# Altium schematic sheet Power.SchDoc
size A4
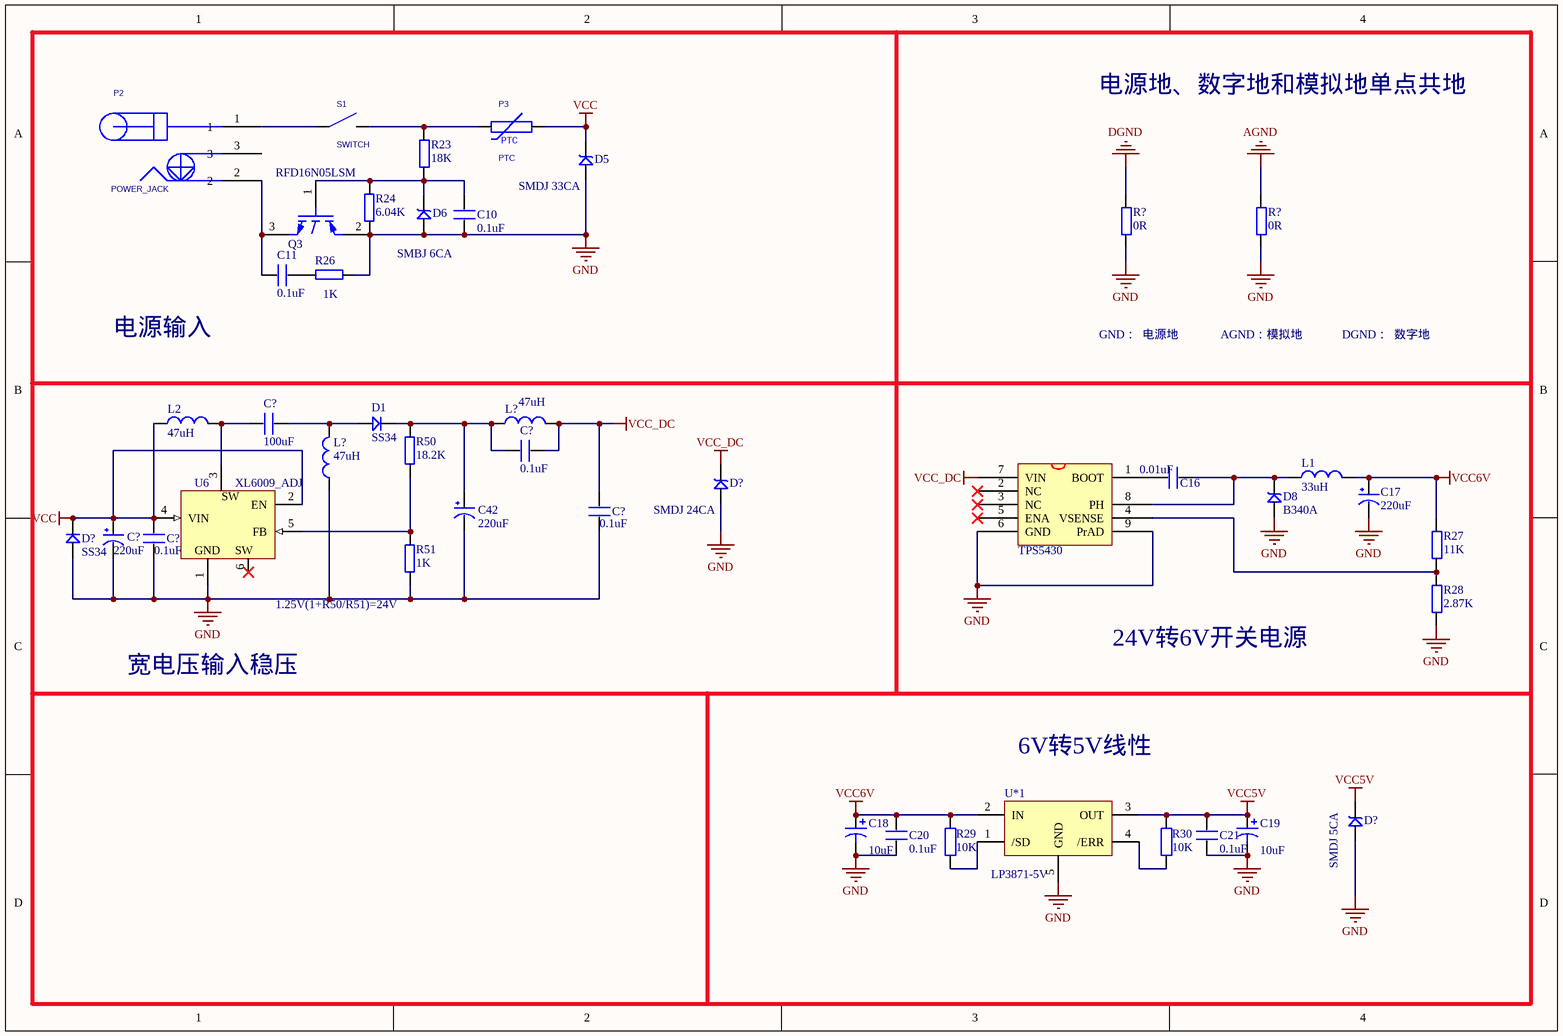
[diagram p0: Power.SchDoc]

## Parts
(Parts that share a designator on the sheet are numbered #1, #2 ... from top to bottom, then left to right.)
C10  0.1uF  [0603]
C11  0.1uF  [0603]
C16  0.01uF  [0603]
C17  220uF  [CAP-7343]
C18  value 10uF  [CAP-3216]  (hidden comment: Cap Pol3)
C19  value 10uF  [CAP-3216]  (hidden comment: Cap Pol3)
C20  0.1uF  [0603]
C21  0.1uF  [0603]
C42  220uF  [SMD6]
C?#1  100uF  [0603]
C?#2  0.1uF  [0603]
C?#3  0.1uF  [0603]
C?#4  0.1uF  [0603]
C?#5  220uF  [SMD6]
D1  SS34  [DO-214AC]
D5  SMDJ 33CA  [DO-214AA]
D6  SMBJ 6CA  [DO-214AA]
D8  B340A  [SMBJ]
D?#1  SMDJ 24CA  [DO-214AA]
D?#2  SS34  [DO-214AC]
D?#3  SMDJ 5CA  [DO-214AA]
L1  value 33uH  [L-SMD-10]  (hidden comment: Inductor)
L2  value 47uH  [L-SMD-12]  (hidden comment: Inductor)
L?#1  value 47uH  [L-SMD-10]  (hidden comment: Inductor)
L?#2  value 47uH  [L-SMD-12]  (hidden comment: Inductor)
P2  POWER_JACK  [DC_IN]
P3  PTC  [1812]
Q3  RFD16N05LSM  [TO-252AA]
R23  18K  [0603]
R24  6.04K  [0603]
R26  1K  [0603]
R27  11K  [0603]
R28  2.87K  [0603]
R29  value 10K  [0603]  (hidden comment: Res1)
R30  value 10K  [0603]  (hidden comment: Res1)
R50  18.2K  [0603]
R51  1K  [0603]
R?#1  0R  [0603]
R?#2  0R  [0603]
S1  SWITCH  [Switch_2mm]
TPS5430  TPS  [NSO8_TP4056]  (value not drawn)
U6  XL6009_ADJ  [TO-263-5]
U*1  LP3871-5V  [SOT-223-5]

## Nets
AGND: R?#2.2
DGND: R?#1.2
GND: C10.2 C17.2(GND) C18.2 C19.2 C20.2 C21.2 C42.2(GND) C?#3.2 C?#4.2 C?#5.2(GND) D5.1 D6.1 D8.1 D?#1.1 D?#2.2 D?#3.1 L?#2.1 Q3.2(C) R24.2 R26.1 R28.1 R51.2 R?#1.1 R?#2.1 TPS5430.6(GND) TPS5430.9(PrAD) U6.1(GND) U*1.5(GND)
VCC: C?#4.1 C?#5.1(VCC) D5.2 D?#2.1 L2.1 P3.2 U6.2(EN) U6.4(VIN)
VCC5V: C19.1 C21.1 D?#3.2 R30.2 U*1.3(OUT)
VCC6V: C17.1(VCC) C18.1 C20.1 L1.2 R27.2 R29.2 U*1.2(IN)
VCC_DC: C?#2.2 C?#3.1 D?#1.2 L?#1.2 TPS5430.7(VIN)
NetC10_1: C10.1 D6.2 Q3.1(G) R23.1 R24.1
NetC11_1: C11.1 R26.2
NetC11_2: C11.2 P2.2 Q3.3(E)
NetC16_1: C16.1 TPS5430.1(BOOT)
NetC16_2: C16.2 D8.2 L1.1 TPS5430.8(PH)
NetC42_1: C42.1(VCC) C?#2.1 D1.1 L?#1.1 R50.1
NetC?#1_1: C?#1.1 L2.2 U6.3(SW)
NetC?#1_2: C?#1.2 D1.2 L?#2.2
NetP2_1: P2.1 S1.2
NetP3_1: P3.1 R23.2 S1.1
NetR27_1: R27.1 R28.2 TPS5430.4(VSENSE)
NetR29_1: R29.1 U*1.1(/SD)
NetR30_1: R30.1 U*1.4(/ERR)
NetR50_2: R50.2 R51.1 U6.5(FB)

Not connected (* = marked no-connect by the designer): P2 3; TPS5430 2(NC)* 3(NC)* 5(ENA)*; U6 6(SW)*

## Notes on the sheet
- 电源地、数字地和模拟地单点共地
- 电源输入
- GND：  电源地
- AGND：模拟地
- DGND：  数字地
- 1.25V(1+R50/R51)=24V
- 24V转6V开关电源
- 宽电压输入稳压
- 6V转5V线性

## Library data of the parts
C10 C11 = C_0.1uF: Cap,0.1uF,104; Terabits Part Number: 1C-0000001-XX; Part Type: CAP 0603
C16 C20 C21 C?#1-C?#4 = C
C17 = CAP: 钽电容/220uF(227) ±10% 16V
C18 C19 = Cap Pol3: Polarized Capacitor (Surface Mount); Published: 8-Jun-2000; LatestRevisionDate: 29-May-2009; LatestRevisionNote: IPC-7351 Footprint Added.; PackageReference: C0805; Publisher: Altium Limited; PackageDescription: Chip Capacitor
C42 C?#5 = CAP+_100uF: 钽电容 SMD 6.3*5.5  50V; Terabits Part Number: 1C-0000013-XX; Manufacture Part Number: *; Manufacture: *; Part Type: DIP CAP+,special
D1 D?#2 = D_DIODE LRB: MPN: LRB551V-30T1G; MAN: LRC; TPN: 1D-0000013-XX
D5 D6 D?#1 D?#3 = SMBJ 6.5CA: TVS,SMBJ 6.5CA,600W SMD Transient Voltage Suppressor Diodes,; Terabits Part Number: 1D-0000001-XX; Manufacture: LRC; Part Type: Diode; Manufacture Part Number: SMBJ 6.5CA
D8 = SMBJ: TVS
L1 L2 L?#1 L?#2 = Inductor: 电感; Code_IEC: 1005; Published: 8-Jun-2000; LatestRevisionDate: 17-Jul-2002; LatestRevisionNote: Re-released for DXP Platform.; PackageReference: 0402-A; Publisher: Altium Limited; Code_JEITA: 0402
Q3 = IGBT-N: Insulated Gate Bipolar Transistor (N-Channel); Published: 8-Jun-2000; LatestRevisionDate: 17-Jul-2002; LatestRevisionNote: Re-released for DXP Platform.; DatasheetVersion: PD-9.684A; PackageReference: TO-247; Publisher: Altium Limited; PackageDescription: SIP with Mounting Hole; 3 Leads; Body 20 x 15.6 x 5 mm (typ); Pitch 5.45 mm; Code_JEDEC: TO-247-AC; ComponentLink1Description: Manufacturer Link; ComponentLink1URL: http://www.irf.com/
R23 R24 R26-R28 R50 R51 = R
R29 R30 = Res1: 贴片电阻; Published: 8-Jun-2000; LatestRevisionDate: 17-Jul-2002; LatestRevisionNote: Re-released for DXP Platform.; PackageReference: AXIAL-0.4; Publisher: Altium Limited
R?#1 R?#2 = R_1K: Res,1K,0603; TPN: 1R-0000008-XX
TPS5430 = TPS5430: 降压开关电源芯片; Published: 8-Jun-2000; LatestRevisionDate: 17-Jul-2002; LatestRevisionNote: Re-released for DXP Platform.; PackageReference: RAD-0.3; Publisher: Altium Limited
U6 = XL6009: 宽输入DCDC稳压芯片; Note: Tab is connected to GND; Published: 15-Apr-2002; DatasheetVersion: Dec-1997; PackageReference: TS5B; Publisher: Altium Limited; PackageDescription: D2-PAK; 5 Leads; Body 14.4 (inc. leads) x 10.4 mm (LxW max); ComponentLink1Description: Manufacturer Link; ComponentLink1URL: http://www.national.com/; ComponentLink2Description: Datasheet; ComponentLink2URL: http://www.national.com/ds.cgi/LM/LM2596.pdf; ComponentLink3Description: URL Link1; ComponentLink3URL: http://www.national.com/pf/LM/LM2596.html
U*1 = LP3871: LDO电源芯片5V; Published: 8-Jun-2000; LatestRevisionDate: 17-Jul-2002; LatestRevisionNote: Re-released for DXP Platform.; PackageReference: RAD-0.3; Publisher: Altium Limited